# Altium schematic sheet Atmega328P.SchDoc
size A4
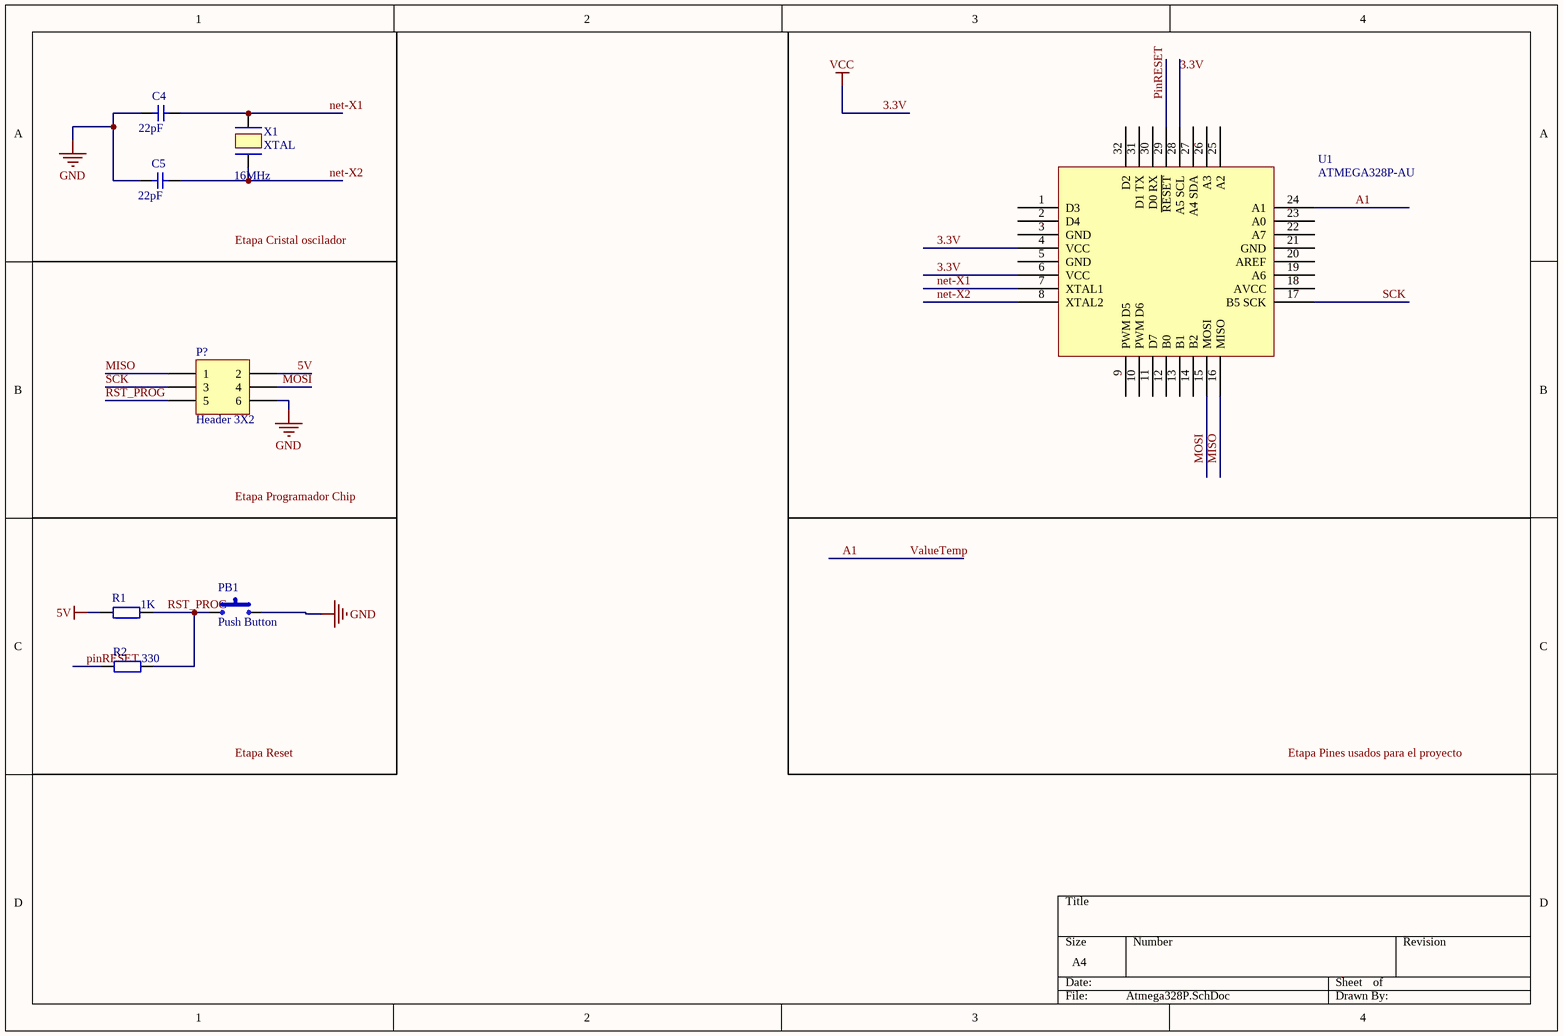
[diagram p0: Atmega328P.SchDoc]

## Parts
C4  value 22pF  [C1206-1.25]  (hidden comment: C1)
C5  value 22pF  [C1206-1.25]  (hidden comment: C2)
P?  Header 3X2  [HDR2X3]
PB1  Push Button  [Tack Switch 6x6 1mm TH]
R1  value 1K  [R1206-0.55]  (hidden comment: R)
R2  value 330  [R1206-0.55]  (hidden comment: R)
U1  ATMEGA328P-AU  [TQFP80P900X900X120-32N]
X1  XTAL  value 16MHz  [2-SMD]

## Nets
3.3V: U1.4(VCC) U1.6(VCC) U1.28(A5_SCL)  [also labelled VCC]
5V: P?.2 R1.1
GND: C4.1 C5.1 P?.6 PB1.2
A1: U1.24(A1)  [also labelled ValueTemp]
MISO: P?.1 U1.16(MISO)
MOSI: P?.4 U1.15(MOSI)
net-X1: C4.2 U1.7(XTAL1) X1.2
net-X2: C5.2 U1.8(XTAL2) X1.1
pinRESET: R2.1 U1.29(~{RESET})
RST_PROG: P?.5 PB1.1 R1.2 R2.2
SCK: P?.3 U1.17(B5_SCK)

Not connected (* = marked no-connect by the designer): U1 1(D3) 2(D4) 3(GND) 5(GND) 9(PWM_D5) 10(PWM_D6) 11(D7) 12(B0) 13(B1) 14(B2) 18(AVCC) 19(A6) 20(AREF) 21(GND) 22(A7) 23(A0) 25(A2) 26(A3) 27(A4_SDA) 30(D0_RX) 31(D1_TX) 32(D2)

## Notes on the sheet
- Labels drawn without touching a wire or pin: Etapa Cristal oscilador, Etapa Pines usados para el proyecto, Etapa Programador Chip, Etapa Reset

## Library data of the parts
C4 C5 = C: Capacitor, generic
P? = Header 3X2: Header, 3-Pin, Dual row; LatestRevisionDate: 17-Jul-2002; LatestRevisionNote: Re-released for DXP Platform.; Publisher: Altium Limited
R1 R2 = R: Resistor, generic
U1 = ATMEGA328P-AU: Microchip Technology ATMEGA328P-AN, 8bit AVR Microcontroller, 20MHz, 32 kB Flash, 32-Pin TQFP; Company: Gueni; Created By: Mohamed Gueni; Date: 20 October 2018; RS Stock No: 131-0271; Datasheet URL: https://docs-emea.rs-online.com/webdocs/15b8/0900766b815b8e7b.pdf
X1 = XTAL: Crystal, Generic